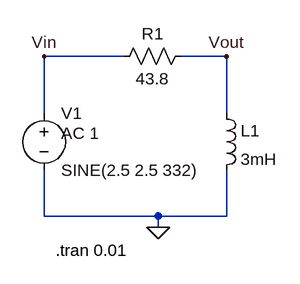
[diagram p0: schematic OLD_ms3_first_order_filter_phasors.asc]
OLD_ms3_first_order_filter_phasors.asc, the LTspice schematic file:
Version 4
SHEET 1 880 680
WIRE 64 -496 -48 -496
WIRE 208 -496 144 -496
WIRE -48 -416 -48 -496
WIRE 208 -416 208 -496
WIRE -48 -272 -48 -336
WIRE 112 -272 -48 -272
WIRE 208 -272 208 -336
WIRE 208 -272 112 -272
WIRE 112 -256 112 -272
FLAG 112 -256 0
FLAG 208 -496 Vout
FLAG -48 -496 Vin
SYMBOL ind 192 -432 R0
SYMATTR InstName L1
SYMATTR Value 3mH
SYMBOL res 48 -480 R270
WINDOW 0 32 56 VTop 2
WINDOW 3 0 56 VBottom 2
SYMATTR InstName R1
SYMATTR Value 43.8
SYMBOL voltage -48 -432 R0
WINDOW 123 24 44 Left 2
WINDOW 39 0 0 Left 0
SYMATTR Value2 AC 1
SYMATTR InstName V1
SYMATTR Value SINE(2.5 2.5 332)
TEXT -32 -224 Left 2 !.tran 0.01

The netlist it stands for:
* OLD_ms3_first_order_filter_phasors.asc
L1 Vout 0 3mH
R1 Vin Vout 43.8
V1 Vin 0 SINE(2.5 2.5 332) AC 1
.tran 0.01
.backanno
.end